# Altium schematic sheet Aux_Power.SchDoc
size C; SheetNumber: 2; SheetTotal: 5
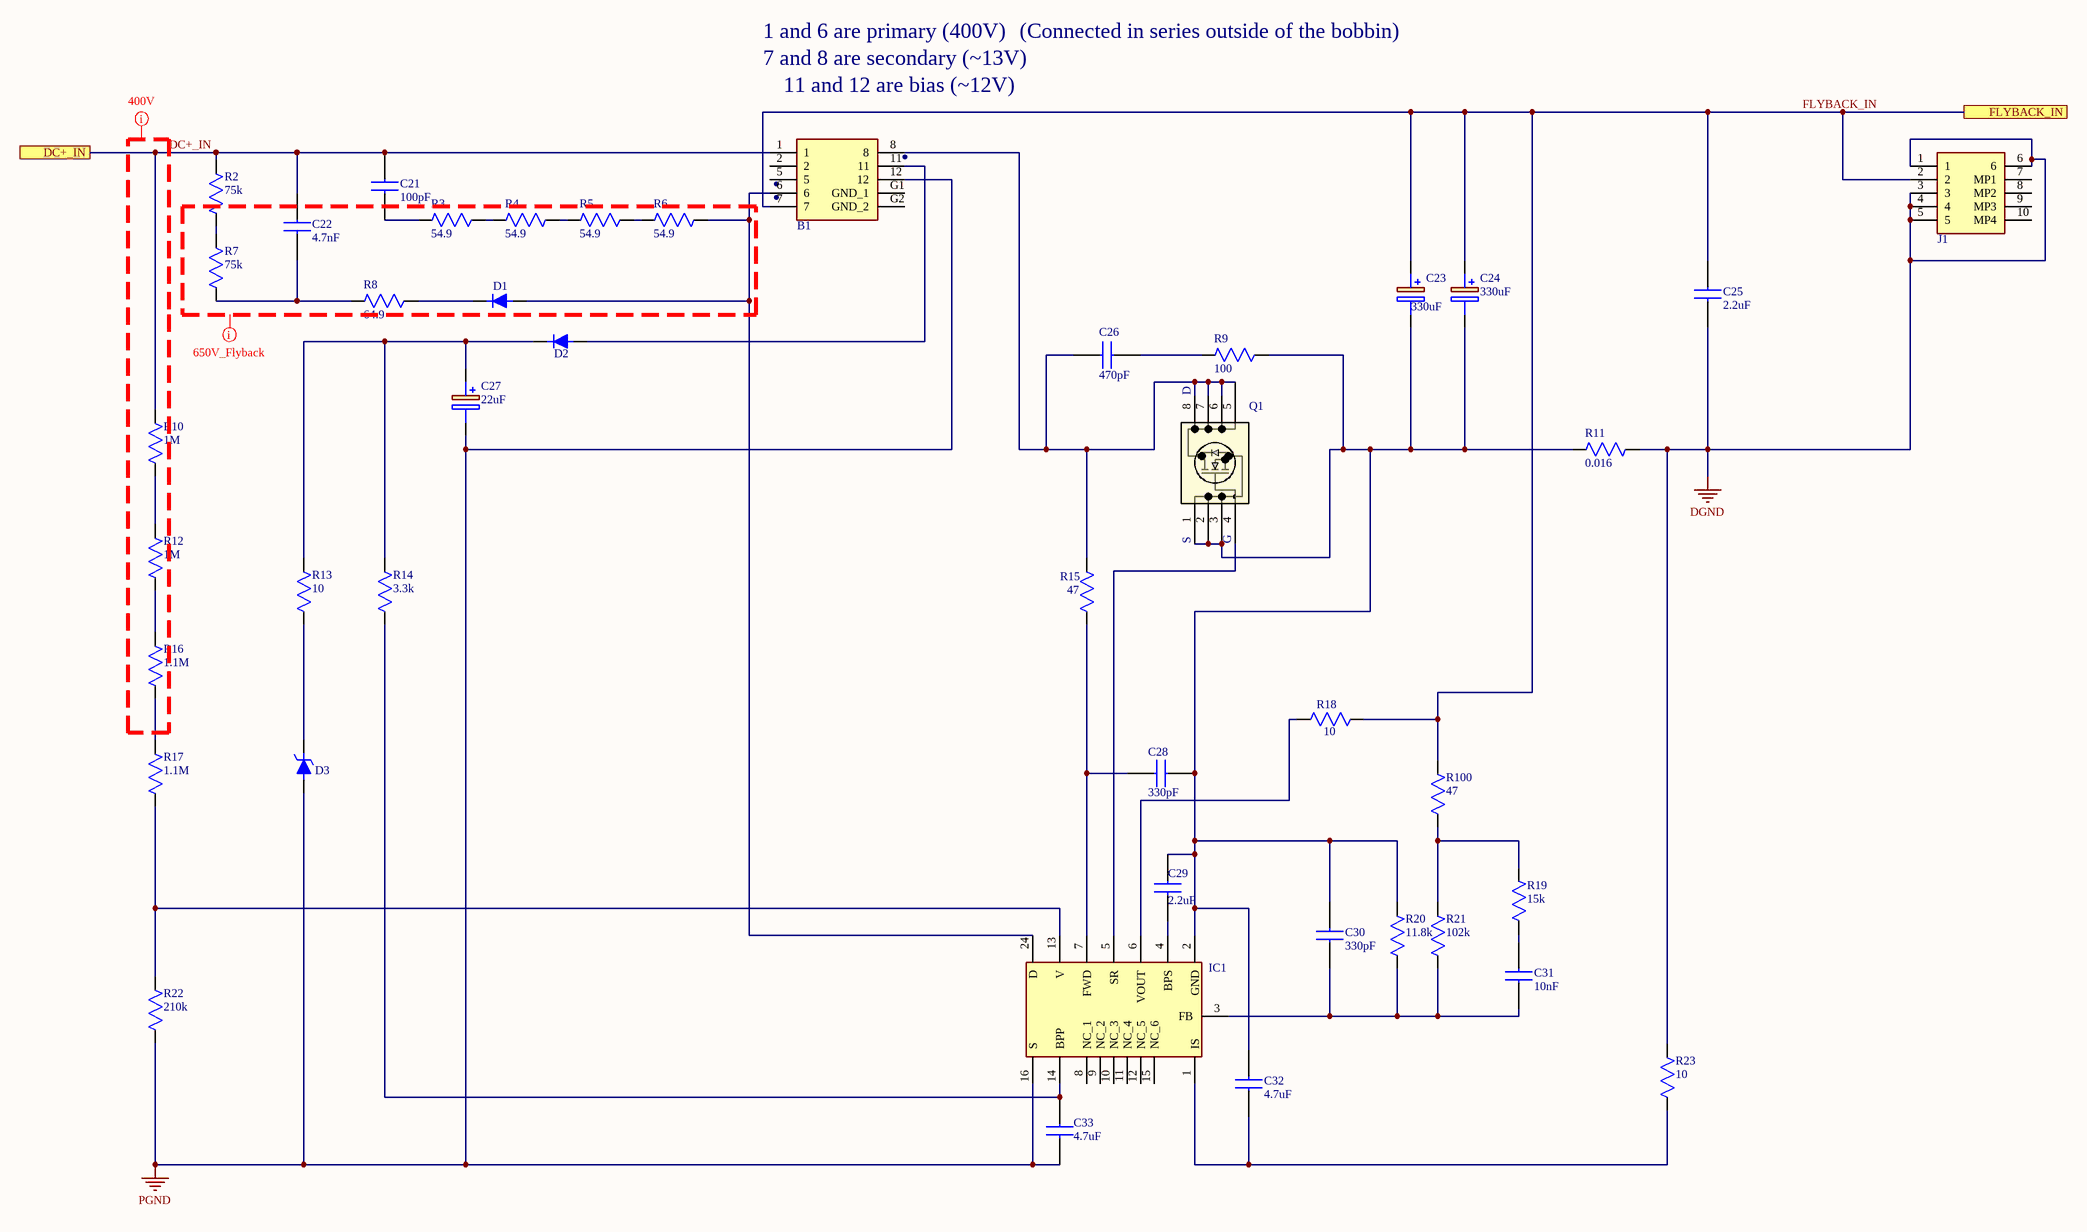
[diagram p0: Aux_Power.SchDoc]

## Parts
B1  B65812N1008D001  [B65812N1008D001 - duplicate]  (value not drawn)
C21  100pF  [Cap 0805]
C22  4.7nF  [Cap 0805]
C23  330uF  [CAPPC6465X560N]
C24  330uF  [CAPPC6465X560N]
C25  2.2uF  [Cap 0805]
C26  470pF  [Cap 0805]
C27  22uF  [CAP_195D_R_VIS]
C28  330pF  [Cap 0805]
C29  2.2uF  [Cap 0805]
C30  330pF  [Cap 0805]
C31  10nF  [Cap 0805]
C32  4.7uF  [Cap 0805]
C33  4.7uF  [Cap 0805]
D1  637-S2T  [DO-214AA_SMB]  (value not drawn)
D2  BAV21WS-7-F  [SOD2513X120N]  (value not drawn)
D3  MMSZ5247BT1G  [SOD3716X135N]  (value not drawn)
IC1  Flyback converter IC  [INN3694CH606TL]  (value not drawn)
J1  0527450696  [0527450696]  (value not drawn)
Q1  AON6250  [AON6250]  (value not drawn)
R2  75k  [Resistor 0805]
R3  54.9  [RESISTOR 1210]
R4  54.9  [RESISTOR 1210]
R5  54.9  [RESISTOR 1210]
R6  54.9  [RESISTOR 1210]
R7  75k  [Resistor 0805]
R8  64.9  [RESISTOR 2512]
R9  100  [Resistor 1206]
R10  1M  [Resistor 0805]
R11  0.016  [Resistor 1206]
R12  1M  [Resistor 0805]
R13  10  [Resistor 0805]
R14  3.3k  [Resistor 0805]
R15  47  [Resistor 0805]
R16  1.1M  [Resistor 0805]
R17  1.1M  [Resistor 0805]
R18  10  [Resistor 0805]
R19  15k  [Resistor 0805]
R20  11.8k  [Resistor 0603]
R21  102k  [Resistor 0603]
R22  210k  [Resistor 0805]
R23  10  [Resistor 0805]
R100  47  [Resistor 0805]

## Ports
DC+_IN (see Power_Board[1B], Pri_Gate_Driver[3B], Pri_Gate_Driver[6B]), FLYBACK_IN (see Pri_Gate_Driver[1B], Pri_Gate_Driver[1C], Pri_Gate_Driver[4B], Pri_Gate_Driver[4C], Sec_Gate_Driver[1B], Sec_Gate_Driver[1C], Sec_Gate_Driver[3B], Sec_Gate_Driver[3C], Sensing[1B])

## Nets
DGND: C25.1 J1.1 J1.3 J1.4 J1.5 J1.6 R11.2 R23.2
PGND: B1.12 C27.2(-) C33.1 D3.1 IC1.16(S) R22.1
DC+_IN: B1.1 C21.2 C22.2 R2.2 R10.2 ; port DC+_IN
FLYBACK_IN: B1.7 C23.1(+) C24.1(+) C25.2 J1.2 R18.1 R100.2 ; port FLYBACK_IN
NetB1_6: B1.6 D1.1 IC1.24(D) R6.2
NetB1_8: B1.8 C26.1 Q1.5 Q1.6 Q1.7 Q1.8 R15.2
NetB1_11: B1.11 D2.1
NetC21_1: C21.1 R3.1
NetC22_1: C22.1 R7.1 R8.1
NetC23_2: C23.2(-) C24.2(-) C28.2 C29.2 C30.1 C32.1 IC1.2(GND) Q1.1 Q1.2 Q1.3 R9.2 R11.1 R20.2
NetC26_2: C26.2 R9.1
NetC27_1: C27.1(+) D2.2 R13.2 R14.2
NetC28_1: C28.1 IC1.7(FWD) R15.1
NetC29_1: C29.1 IC1.4(BPS)
NetC30_2: C30.2 C31.2 IC1.3(FB) R20.1 R21.1
NetC31_1: C31.1 R19.2
NetC32_2: C32.2 IC1.1(IS) R23.1
NetC33_2: C33.2 IC1.14(BPP) R14.1
NetD1_2: D1.2 R8.2
NetD3_2: D3.2 R13.1
NetIC1_5: IC1.5(SR) Q1.4
NetIC1_6: IC1.6(VOUT) R18.2
NetIC1_13: IC1.13(V) R17.1 R22.2
NetR2_1: R2.1 R7.2
NetR3_2: R3.2 R4.1
NetR4_2: R4.2 R5.1
NetR5_2: R5.2 R6.1
NetR10_1: R10.1 R12.2
NetR12_1: R12.1 R16.2
NetR16_1: R16.1 R17.2
NetR19_1: R19.1 R21.2 R100.1

Not connected (* = marked no-connect by the designer): B1 2 5 G1(GND_1) G2(GND_2); IC1 8(NC_1) 9(NC_2) 10(NC_3) 11(NC_4) 12(NC_5) 15(NC_6); J1 7(MP1) 8(MP2) 9(MP3) 10(MP4)

## Layout directives
net class 650V_Flyback: (no net found under the mark)
net class 400V: DC+_IN

## Notes on the sheet
- 1 and 6 are primary (400V)
- 7 and 8 are secondary (~13V)
- (Connected in series outside of the bobbin)
- 11 and 12 are bias (~12V)
- (near B1) .
- (in symbol AON6250) D; S; G

## Library data of the parts
B1 = B65812N1008D001: BOBBIN COIL FORMER RM 8; Manufacturer_Name: TDK; Datasheet Link: https://product.tdk.com/system/files/dam/doc/product/ferrite/ferrite/ferrite-acc/data_sheet/80/db/fer/rm_8.pdf; Height: 11.55mm; Manufacturer_Part_Number: B65812N1008D001; Mouser Part Number: 871-B65812N1008D001; Mouser Price/Stock: https://www.mouser.co.uk/ProductDetail/EPCOS-TDK/B65812N1008D001?qs=%2FsLciWRBLmAhX8H95BubLg%3D%3D; Arrow Part Number: B65812N1008D001; Arrow Price/Stock: https://www.arrow.com/en/products/b65812n1008d001/epcos-tdk
C21 = 885342207015: CAP CER 100PF 1000V X7R 0805
C22 = C2012C0G2W472J125AA: CAP CER 4700PF 450V C0G 0805
C23 C24 = 597D337X0020H2T: CAP TANT 330UF 20% 20V 3226
C25 C29 = CL21B225KAFNFNE: 2.2 µF ±10% 25V Ceramic Capacitor X7R 0805 (2012 Metric)
C26 = 885012207114: CAP CER 470PF 100V X7R 0805
C27 = 195D226X9035R2T: CAP TANT 22UF 10% 35V 2824
C28 = GCM21A5C2E331JX01D: 330 pF ±5% 250V Ceramic Capacitor C0G, NP0 0805 (2012 Metric)
C30 = CC0805KRX7R9BB331: 330 pF ±10% 50V Ceramic Capacitor X7R 0805 (2012 Metric)
C31 = CC0805KRX7R8BB103: CAP CER 10000PF 25V X7R 0805
C32 = LMK212B7475KGHT: 4.7 µF ±10% 10V Ceramic Capacitor X7R 0805 (2012 Metric)
C33 = CL21B475KOFNNNE: 4.7 µF ±10% 16V Ceramic Capacitor X7R 0805 (2012 Metric)
D1 = 637-S2T: Diotec Semiconductor              Rectifiers Diode, SMB, 1300V, 2A; Manufacturer_Name: MCC; Manufacturer_Part_Number: UFM13PL-TP; Datasheet Link: https://mccsemi.com/pdf/Products/UFM11PL-UFM17PL(SOD-123FL).pdf; Height: 1.2mm; Mouser Part Number: 833-UFM13PL-TP; Mouser Price/Stock: https://www.mouser.co.uk/ProductDetail/Micro-Commercial-Components-MCC/UFM13PL-TP?qs=SdqRYZZ9IxAD4hhX9Lvchg%3D%3D; Arrow Part Number: UFM13PL-TP; Arrow Price/Stock: https://www.arrow.com/en/products/ufm13pl-tp/micro-commercial-components
D2 = BAV21WS-7-F: DIODE STANDARD 200V 200MA SOD323; Manufacturer_Name: MCC; Manufacturer_Part_Number: UFM13PL-TP; Datasheet Link: https://mccsemi.com/pdf/Products/UFM11PL-UFM17PL(SOD-123FL).pdf; Height: 1.2mm; Mouser Part Number: 833-UFM13PL-TP; Mouser Price/Stock: https://www.mouser.co.uk/ProductDetail/Micro-Commercial-Components-MCC/UFM13PL-TP?qs=SdqRYZZ9IxAD4hhX9Lvchg%3D%3D; Arrow Part Number: UFM13PL-TP; Arrow Price/Stock: https://www.arrow.com/en/products/ufm13pl-tp/micro-commercial-components
D3 = MMSZ5247BT1G: Zener Diode 17 V 500 mW ±5% Surface Mount SOD-123; Manufacturer_Name: MCC; Manufacturer_Part_Number: UFM13PL-TP; Datasheet Link: https://mccsemi.com/pdf/Products/UFM11PL-UFM17PL(SOD-123FL).pdf; Height: 1.2mm; Mouser Part Number: 833-UFM13PL-TP; Mouser Price/Stock: https://www.mouser.co.uk/ProductDetail/Micro-Commercial-Components-MCC/UFM13PL-TP?qs=SdqRYZZ9IxAD4hhX9Lvchg%3D%3D; Arrow Part Number: UFM13PL-TP; Arrow Price/Stock: https://www.arrow.com/en/products/ufm13pl-tp/micro-commercial-components
IC1 = INN3694C-H606-TL: Converter Offline Flyback, Secondary Side SR Topology 100kHz InSOP-24D; Manufacturer_Name: Power Integrations; Datasheet Link: https://datasheet.datasheetarchive.com/originals/distributors/Datasheets_SAMA/928547a93ec9bf8fb4487e301170f925.pdf; Height: 1.6mm; Manufacturer_Part_Number: INN3694C-H606-TL; Mouser Part Number: 869-INN3694C-H606-TL; Mouser Price/Stock: https://www.mouser.co.uk/ProductDetail/Power-Integrations/INN3694C-H606-TL?qs=T3oQrply3y9J5l%252BdHPsr%2FQ%3D%3D
J1 = 0527450696: CONN FFC FPC TOP 6POS 0.5MM R/A; Manufacturer_Name: Molex; Datasheet Link: https://www.molex.com/content/dam/molex/molex-dot-com/products/automated/en-us/salesdrawingpdf/527/52745/527450696_sd.pdf?inline; Height: 2mm; Manufacturer_Part_Number: 0527450696; Mouser Part Number: N/A; Mouser Price/Stock: https://www.mouser.co.uk/ProductDetail/Molex/0527450696?qs=PBcRNPEHKspDQteIzUIw7A%3D%3D; Arrow Part Number: 0527450696; Arrow Price/Stock: null?region=nac
Q1 = AON6250: MOSFET N-CH 150V 13.5A/52A 8DFN; Mfr_Name: Alpha and Omega Semiconductor; Type: Transistors; RefDes: RefDes
R2 R7 = RMCF0805FT75K0: RES 75K OHM 1% 1/8W 0805
R3-R6 = RMCF1210FT54R9: RES 54.9 OHM 1% 1/2W 1210
R8 = RMCF2512FT64R9: RES 64.9 OHM 1% 1W 2512
R9 = RMCF1206FG100R: RES 100 OHM 1% 1/4W 1206
R10 R12 = RG2012P-105-B-T5: RES SMD 1M OHM 0.1% 1/8W 0805
R11 = RL1206FR-070R016L: RES 0.016 OHM 1% 1/4W 1206
R13 R18 = CR0805-10W-10R0FT: RES 10 OHM 1% 1/10W 0805
R14 = RMCF0805FT3K30: RES 3.3K OHM 1% 1/8W 0805
R15 R100 = RK73H2ATTD47R0F: RES 47 OHM 1% 1/4W 0805
R16 R17 = CPF0805B1M1E1: RES SMD 1.1M OHM 0.1% 1/10W 0805
R19 = CR0805-10W-1502FT-CT: CHIP RESISTOR,0805,1/10W, 15K,1%
R20 = ERJ-3EKF1182V: RES SMD 11.8K OHM 1% 1/10W 0603
R21 = ERJ-3EKF1023V: RES SMD 102K OHM 1% 1/10W 0603
R22 = ERA-6AEB2103V: RES SMD 210K OHM 0.1% 1/8W 0805
R23 = ERJ-6ENF10R0V: RES SMD 10 OHM 1% 1/8W 0805